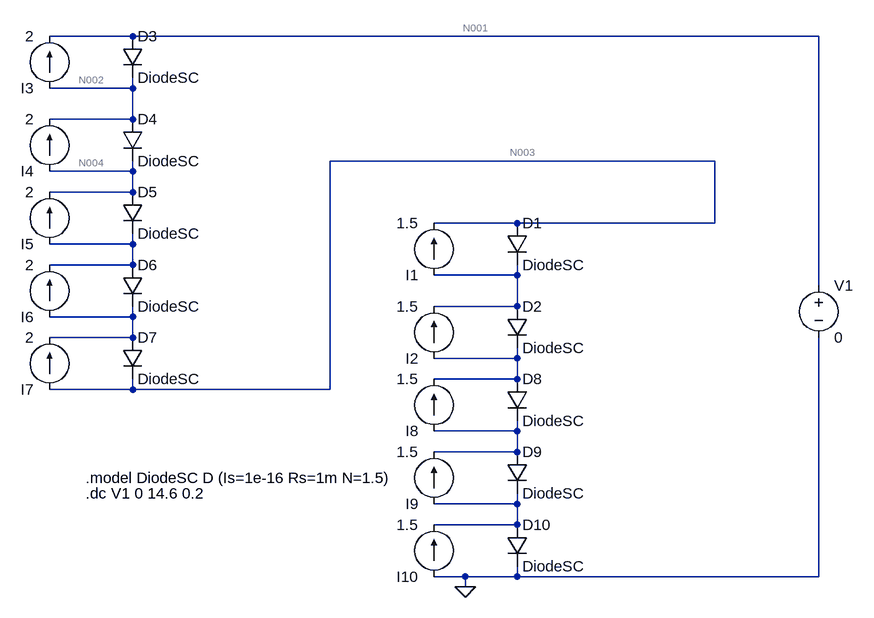
[diagram p0: schematic 7.asc]
7.asc, the LTspice schematic file:
Version 4
SHEET 1 880 824
WIRE -608 -96 -736 -96
WIRE 448 -96 -608 -96
WIRE -608 -16 -608 -32
WIRE -608 -16 -736 -16
WIRE -608 32 -608 -16
WIRE -608 32 -736 32
WIRE 288 96 -304 96
WIRE -608 112 -608 96
WIRE -608 112 -736 112
WIRE -608 144 -608 112
WIRE -608 144 -736 144
WIRE -608 160 -608 144
WIRE -16 192 -144 192
WIRE 288 192 288 96
WIRE 288 192 -16 192
WIRE -608 224 -608 208
WIRE -608 224 -736 224
WIRE -608 256 -608 224
WIRE -608 256 -736 256
WIRE -16 272 -16 256
WIRE -16 272 -144 272
WIRE 448 288 448 -96
WIRE -16 320 -16 272
WIRE -16 320 -144 320
WIRE -608 336 -608 320
WIRE -608 336 -736 336
WIRE -608 368 -608 336
WIRE -608 368 -736 368
WIRE -16 400 -16 384
WIRE -16 400 -144 400
WIRE -16 432 -16 400
WIRE -16 432 -144 432
WIRE -608 448 -608 432
WIRE -608 448 -736 448
WIRE -304 448 -304 96
WIRE -304 448 -608 448
WIRE -16 448 -16 432
WIRE -16 512 -16 496
WIRE -16 512 -144 512
WIRE -16 544 -16 512
WIRE -16 544 -144 544
WIRE -16 624 -16 608
WIRE -16 624 -144 624
WIRE -16 656 -16 624
WIRE -16 656 -144 656
WIRE -96 736 -144 736
WIRE -16 736 -16 720
WIRE -16 736 -96 736
WIRE 448 736 448 368
WIRE 448 736 -16 736
WIRE -96 752 -96 736
FLAG -96 752 0
SYMBOL diode -624 -96 R0
SYMATTR InstName D3
SYMATTR Value DiodeSC
SYMBOL current -736 -16 R180
WINDOW 123 0 0 Left 0
WINDOW 39 0 0 Left 0
SYMATTR InstName I3
SYMATTR Value 2
SYMBOL diode -624 32 R0
SYMATTR InstName D4
SYMATTR Value DiodeSC
SYMBOL current -736 112 R180
WINDOW 123 0 0 Left 0
WINDOW 39 0 0 Left 0
SYMATTR InstName I4
SYMATTR Value 2
SYMBOL diode -624 144 R0
SYMATTR InstName D5
SYMATTR Value DiodeSC
SYMBOL current -736 224 R180
WINDOW 123 0 0 Left 0
WINDOW 39 0 0 Left 0
SYMATTR InstName I5
SYMATTR Value 2
SYMBOL diode -624 256 R0
SYMATTR InstName D6
SYMATTR Value DiodeSC
SYMBOL current -736 336 R180
WINDOW 123 0 0 Left 0
WINDOW 39 0 0 Left 0
SYMATTR InstName I6
SYMATTR Value 2
SYMBOL diode -624 368 R0
SYMATTR InstName D7
SYMATTR Value DiodeSC
SYMBOL current -736 448 R180
WINDOW 123 0 0 Left 0
WINDOW 39 0 0 Left 0
SYMATTR InstName I7
SYMATTR Value 2
SYMBOL diode -32 192 R0
SYMATTR InstName D1
SYMATTR Value DiodeSC
SYMBOL current -144 272 R180
WINDOW 123 0 0 Left 0
WINDOW 39 0 0 Left 0
SYMATTR InstName I1
SYMATTR Value 1.5
SYMBOL diode -32 320 R0
SYMATTR InstName D2
SYMATTR Value DiodeSC
SYMBOL current -144 400 R180
WINDOW 123 0 0 Left 0
WINDOW 39 0 0 Left 0
SYMATTR InstName I2
SYMATTR Value 1.5
SYMBOL diode -32 432 R0
SYMATTR InstName D8
SYMATTR Value DiodeSC
SYMBOL current -144 512 R180
WINDOW 123 0 0 Left 0
WINDOW 39 0 0 Left 0
SYMATTR InstName I8
SYMATTR Value 1.5
SYMBOL diode -32 544 R0
SYMATTR InstName D9
SYMATTR Value DiodeSC
SYMBOL current -144 624 R180
WINDOW 123 0 0 Left 0
WINDOW 39 0 0 Left 0
SYMATTR InstName I9
SYMATTR Value 1.5
SYMBOL diode -32 656 R0
SYMATTR InstName D10
SYMATTR Value DiodeSC
SYMBOL current -144 736 R180
WINDOW 123 0 0 Left 0
WINDOW 39 0 0 Left 0
SYMATTR InstName I10
SYMATTR Value 1.5
SYMBOL voltage 448 272 R0
WINDOW 123 0 0 Left 0
WINDOW 39 0 0 Left 0
SYMATTR InstName V1
SYMATTR Value 0
TEXT -680 608 Left 2 !.dc V1 0 14.6 0.2
TEXT -680 584 Left 2 !.model DiodeSC D (Is=1e-16 Rs=1m N=1.5)

The netlist it stands for:
* 7.asc
D3 N001 N002 DiodeSC
I3 N002 N001 2
D4 N002 N004 DiodeSC
I4 N004 N002 2
D5 N004 N005 DiodeSC
I5 N005 N004 2
D6 N005 N007 DiodeSC
I6 N007 N005 2
D7 N007 N003 DiodeSC
I7 N003 N007 2
D1 N003 N006 DiodeSC
I1 N006 N003 1.5
D2 N006 N008 DiodeSC
I2 N008 N006 1.5
D8 N008 N009 DiodeSC
I8 N009 N008 1.5
D9 N009 N010 DiodeSC
I9 N010 N009 1.5
D10 N010 0 DiodeSC
I10 0 N010 1.5
V1 N001 0 0
.model D D
.lib standard.dio
.dc V1 0 14.6 0.2
.model DiodeSC D (Is=1e-16 Rs=1m N=1.5)
.backanno
.end

* Results of the author's LTspice run, read from the files saved beside the schematic
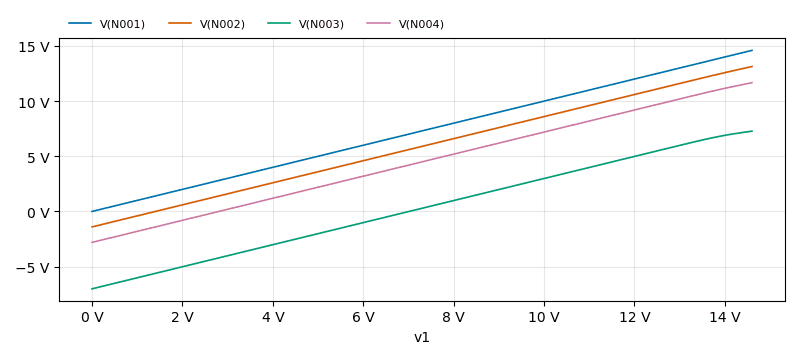
[diagram p1: DC transfer characteristic of 7.asc, plotted from the saved traces]
* DC transfer characteristic, 1 run:
*   V(N001): 0 V at v1=0 V, 14.6 V at v1=14.6 V, min 0 V, max 14.6 V
*   V(N002): -1.403 V at v1=0 V, 13.14 V at v1=14.6 V, min -1.403 V, max 13.14 V
*   V(N003): -7.015 V at v1=0 V, 7.276 V at v1=14.6 V, min -7.015 V, max 7.276 V
*   V(N004): -2.806 V at v1=0 V, 11.67 V at v1=14.6 V, min -2.806 V, max 11.67 V